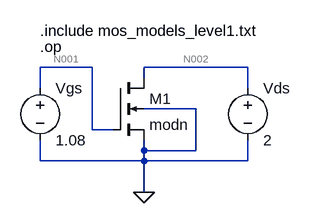
[diagram p0: schematic mos_models_level1.asc]
mos_models_level1.asc, the LTspice schematic file:
Version 4
SHEET 1 880 680
WIRE 128 80 48 80
WIRE 368 80 208 80
WIRE 208 96 208 80
WIRE 48 112 48 80
WIRE 368 112 368 80
WIRE 288 144 208 144
WIRE 128 176 128 80
WIRE 160 176 128 176
WIRE 208 208 208 192
WIRE 288 208 288 144
WIRE 288 208 208 208
WIRE 48 224 48 192
WIRE 208 224 208 208
WIRE 208 224 48 224
WIRE 368 224 368 192
WIRE 368 224 208 224
WIRE 208 272 208 224
FLAG 208 272 0
SYMBOL nmos4 160 96 R0
SYMATTR InstName M1
SYMATTR Value modn
SYMATTR Value2 l=1.5u w=3.5u
SYMBOL voltage 368 96 R0
WINDOW 123 0 0 Left 2
WINDOW 39 0 0 Left 2
SYMATTR InstName Vds
SYMATTR Value 2
SYMBOL voltage 48 96 R0
WINDOW 123 0 0 Left 2
WINDOW 39 0 0 Left 2
SYMATTR InstName Vgs
SYMATTR Value 1.08
TEXT 48 24 Left 2 !.include mos_models_level1.txt
TEXT 48 48 Left 2 !.op

The netlist it stands for:
* mos_models_level1.asc
M1 N002 N001 0 0 modn l=1.5u w=3.5u
Vds N002 0 2
Vgs N001 0 1.08
.model NMOS NMOS
.model PMOS PMOS
.lib standard.mos
.include mos_models_level1.txt
.op
.backanno
.end

* Results of the author's LTspice run, read from the files saved beside the schematic
* Operating Point:
*   V(n002) = 2 V
*   V(n001) = 1.08 V
*   Id(M1) = 448 nA
*   Ig(M1) = 0 A
*   Ib(M1) = -2.01 pA
*   Is(M1) = -448 nA
*   I(Vgs) = 0 A
*   I(Vds) = -448 nA
* From the log:
*   Semiconductor Device Operating Points:
*                           --- MOSFET Transistors ---
*   Name:          m1
*   Model:        modn
*   Id:          4.48e-07
*   Vgs:         1.08e+00
*   Vds:         2.00e+00
*   Vbs:         0.00e+00
*   Vth:         1.00e+00
*   Vdsat:       8.00e-02
*   Gm:          1.12e-05
*   Gds:         3.73e-08
*   Gmb:         3.76e-06
*   Cbd:         0.00e+00
*   Cbs:         0.00e+00
*   Cgsov:       1.75e-15
*   Cgdov:       1.75e-15
*   Cgbov:       0.00e+00
*   Cgs:         8.06e-15
*   Cgd:         0.00e+00
*   Cgb:         0.00e+00